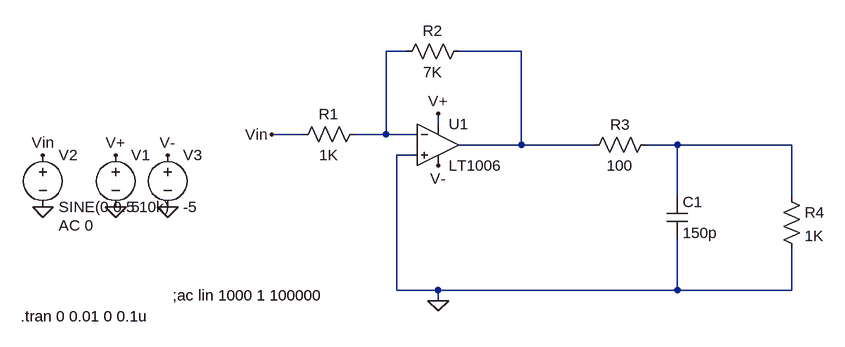
[diagram p0: schematic OPV.asc]
OPV.asc, the LTspice schematic file:
Version 4
SHEET 1 880 680
WIRE 176 0 144 0
WIRE 352 0 256 0
WIRE 224 112 224 96
WIRE 16 128 -32 128
WIRE 144 128 144 0
WIRE 144 128 96 128
WIRE 192 128 144 128
WIRE 352 144 352 0
WIRE 352 144 256 144
WIRE 464 144 352 144
WIRE 592 144 544 144
WIRE 768 144 592 144
WIRE 192 160 160 160
WIRE 592 224 592 144
WIRE 768 224 768 144
WIRE 160 368 160 160
WIRE 224 368 160 368
WIRE 592 368 592 288
WIRE 592 368 224 368
WIRE 768 368 768 304
WIRE 768 368 592 368
WIRE 224 384 224 368
FLAG 224 384 0
FLAG -272 240 0
FLAG -384 240 0
FLAG -272 160 V+
FLAG 224 96 V+
FLAG -384 160 Vin
FLAG -32 128 Vin
FLAG -192 240 0
FLAG -192 160 V-
FLAG 224 176 V-
SYMBOL Opamps\\LT1006 224 80 R0
SYMATTR InstName U1
SYMBOL voltage -272 144 R0
WINDOW 123 0 0 Left 2
WINDOW 39 0 0 Left 2
SYMATTR InstName V1
SYMATTR Value 5
SYMBOL voltage -384 144 R0
WINDOW 123 24 124 Left 2
WINDOW 39 0 0 Left 2
SYMATTR InstName V2
SYMATTR Value SINE(0 0.5 10k)
SYMATTR Value2 AC 0
SYMBOL res 0 144 R270
WINDOW 0 32 56 VTop 2
WINDOW 3 0 56 VBottom 2
SYMATTR InstName R1
SYMATTR Value 1K
SYMATTR SpiceLine tol=1 pwr=0.1
SYMBOL res 160 16 R270
WINDOW 0 32 56 VTop 2
WINDOW 3 0 56 VBottom 2
SYMATTR InstName R2
SYMATTR Value 7K
SYMATTR SpiceLine tol=1 pwr=0.1
SYMBOL res 448 160 R270
WINDOW 0 32 56 VTop 2
WINDOW 3 0 56 VBottom 2
SYMATTR InstName R3
SYMATTR Value 100
SYMATTR SpiceLine tol=1 pwr=0.1
SYMBOL voltage -192 144 R0
WINDOW 123 0 0 Left 2
WINDOW 39 0 0 Left 2
SYMATTR InstName V3
SYMATTR Value -5
SYMBOL cap 576 224 R0
SYMATTR InstName C1
SYMATTR Value 150p
SYMATTR SpiceLine V=25 Irms=18.7m Rser=16.5376 Lser=0
SYMBOL res 752 208 R0
SYMATTR InstName R4
SYMATTR Value 1K
SYMATTR SpiceLine tol=1 pwr=0.1
TEXT -418 408 Left 2 !.tran 0 0.01 0 0.1u
TEXT -184 376 Left 2 !;ac lin 1000 1 100000

The netlist it stands for:
* OPV.asc
XU1 0 N001 V+ V- N002 LT1006  ; pins In+ In- V+ V- OUT
V1 V+ 0 5
V2 Vin 0 SINE(0 0.5 10k) AC 0
R1 Vin N001 1K tol=1 pwr=0.1
R2 N001 N002 7K tol=1 pwr=0.1
R3 N002 N003 100 tol=1 pwr=0.1
V3 V- 0 -5
C1 N003 0 150p V=25 Irms=18.7m Rser=16.5376 Lser=0
R4 N003 0 1K tol=1 pwr=0.1
.tran 0 0.01 0 0.1u
;ac lin 1000 1 100000
.lib LTC.lib
.backanno
.end